# EAGLE design nico (EAGLE 7.1.0)
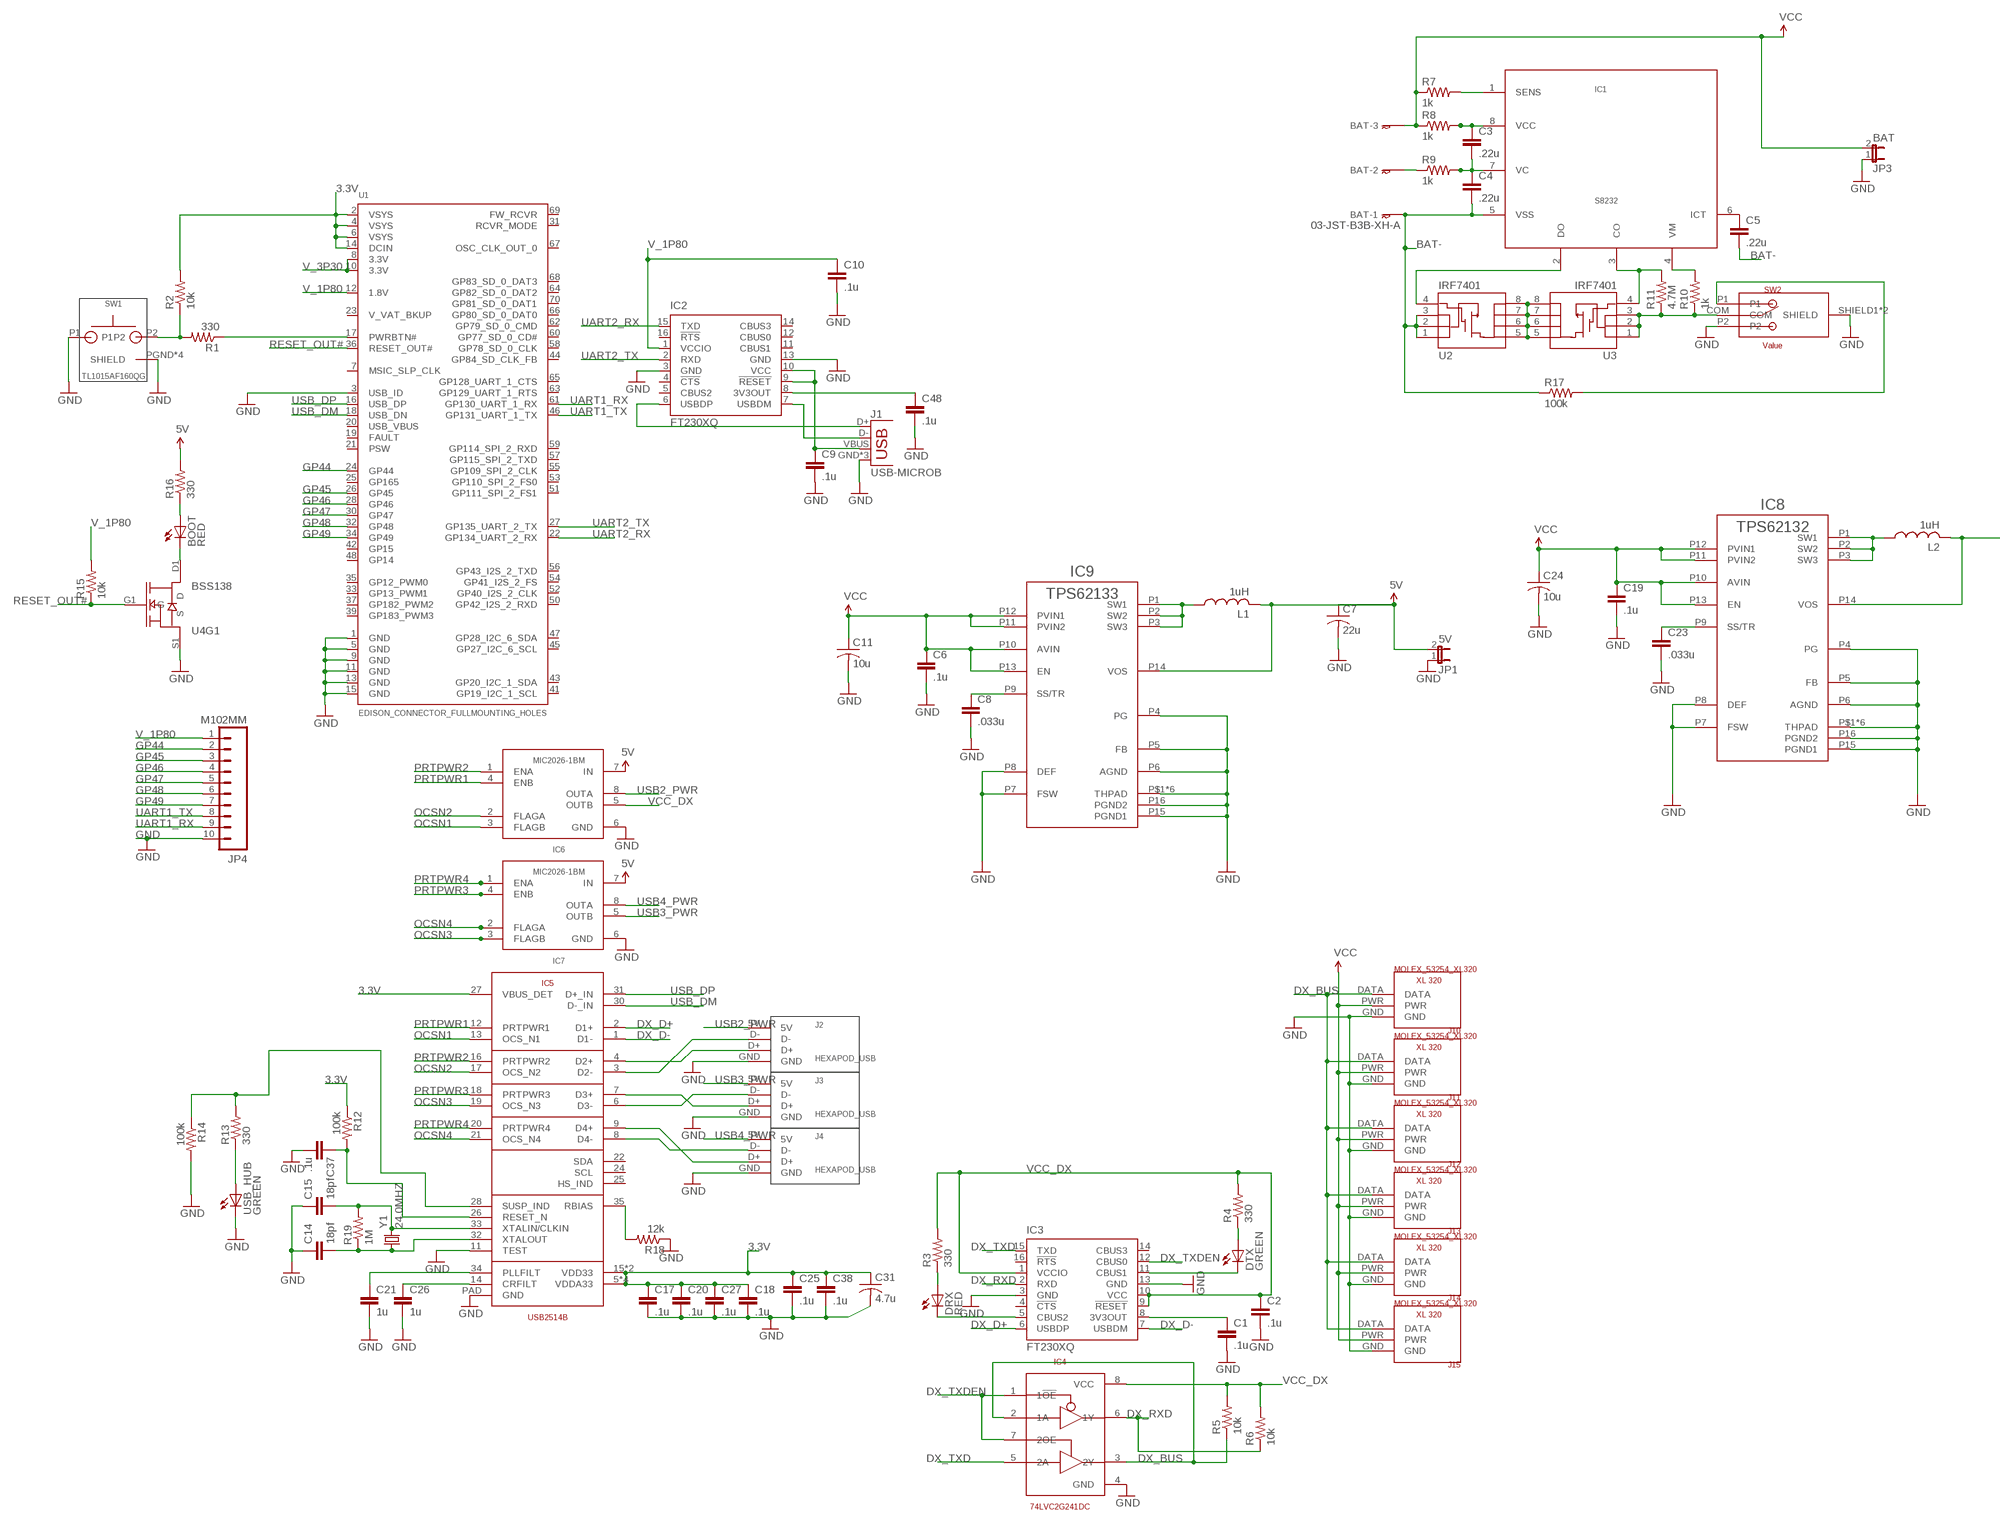
[diagram p0: schematic, sheet 1, part 1 of 2]
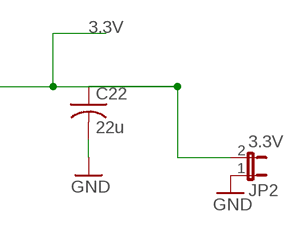
[diagram p1: schematic, sheet 1, part 2 of 2]

## Parts
BAT  03-JST-B3B-XH-A  [B3B-XH]
BOOT  RED  LED0603  [LED-0603]
C1  .1u  C-EUC0402  [C0402]
C2  .1u  C-EUC0402  [C0402]
C3  .22u  C-EUC0402  [C0402]
C4  .22u  C-EUC0402  [C0402]
C5  .22u  C-EUC0402  [C0402]
C6  .1u  C-EUC0402  [C0402]
C7  22u  C-USC0603  [C0603]
C8  .033u  C-EUC0402  [C0402]
C9  .1u  C-EUC0402  [C0402]
C10  .1u  C-EUC0402  [C0402]
C11  10u  C-USC0805  [C0805]
C14  18pf  C-EUC0402  [C0402]
C15  18pf  C-EUC0402  [C0402]
C17  .1u  C-EUC0402  [C0402]
C18  .1u  C-EUC0402  [C0402]
C19  .1u  C-EUC0402  [C0402]
C20  .1u  C-EUC0402  [C0402]
C21  1u  C-EUC0402  [C0402]
C22  22u  C-USC0603  [C0603]
C23  .033u  C-EUC0402  [C0402]
C24  10u  C-USC0805  [C0805]
C25  .1u  C-EUC0402  [C0402]
C26  1u  C-EUC0402  [C0402]
C27  .1u  C-EUC0402  [C0402]
C31  4.7u  C-USC0603  [C0603]
C37  .1u  C-EUC0402  [C0402]
C38  .1u  C-EUC0402  [C0402]
C48  .1u  C-EUC0402  [C0402]
DRX  RED  LED0603  [LED-0603]
DTX  GREEN  LED0603  [LED-0603]
IC1  S8232  [TSSOP8]
IC2  FT230XQ  [QFN16]
IC3  FT230XQ  [QFN16]
IC4  74LVC2G241DC  [VSSOP]
IC5  USB2514B  [36-QFN]
IC6  MIC2026-1BM  [8-SOIC]
IC7  MIC2026-1BM  [8-SOIC]
IC8  TPS62132  TPS62133  [VQFN-16]
IC9  TPS62133  [VQFN-16]
J1  USB-MICROB  [USB-MICROB]
J2  HEXAPOD_USB  [MOLEX_53254_4POS]
J3  HEXAPOD_USB  [MOLEX_53254_4POS]
J4  HEXAPOD_USB  [MOLEX_53254_4POS]
J10  MOLEX_53254_XL320  [MOLES_53254_XL320]
J11  MOLEX_53254_XL320  [MOLES_53254_XL320]
J12  MOLEX_53254_XL320  [MOLES_53254_XL320]
J13  MOLEX_53254_XL320  [MOLES_53254_XL320]
J14  MOLEX_53254_XL320  [MOLES_53254_XL320]
J15  MOLEX_53254_XL320  [MOLES_53254_XL320]
JP1  5V  JUMPER-2PTH  [1X02]
JP2  3.3V  JUMPER-2PTH  [1X02]
JP3  BAT  JUMPER-2PTH  [1X02]
JP4  M102MM  [1X10-2MM]
L1  1uH  L-USL2825P  [L2825P]
L2  1uH  L-USL2825P  [L2825P]
R1  330  R-US_R0402  [R0402]
R2  10k  R-US_R0402  [R0402]
R3  330  R-US_R0402  [R0402]
R4  330  R-US_R0402  [R0402]
R5  10k  R-US_R0402  [R0402]
R6  10k  R-US_R0402  [R0402]
R7  1k  RESISTOR0402  [C0402]
R8  1k  RESISTOR0402  [C0402]
R9  1k  RESISTOR0402  [C0402]
R10  1k  RESISTOR0402  [C0402]
R11  4.7M  RESISTOR0402  [C0402]
R12  100k  RESISTOR0402  [C0402]
R13  330  R-US_R0402  [R0402]
R14  100k  RESISTOR0402  [C0402]
R15  10k  R-US_R0402  [R0402]
R16  330  R-US_R0402  [R0402]
R17  100k  RESISTOR0402  [C0402]
R18  12k  RESISTOR0402  [C0402]
R19  1M  RESISTOR0402  [C0402]
SW1  TL1015AF160QG  [TL1015AF160QG]
SW2  TOGGLE_SWITCH_ET01MD1AGE  [TOGGLE_SWITCH_ET01MD1AGE]
U1  EDISON_CONNECTOR_FULLMOUNTING_HOLES  [EDISON_DAUGHTER]
U2  IRF7401  MOSFET-NCHANNEL-SOIC8  [SO08]
U3  IRF7401  MOSFET-NCHANNEL-SOIC8  [SO08]
U4  BSS138  [SOT363]
USB_HUB  GREEN  LED0603  [LED-0603]
Y1  24.0MHZ  CRYSTAL5X3  [CRYSTAL-SMD-5X3]

## Nets
3.3V: C17.1 C18.1 C20.1 C22.1 C25.1 C27.1 C31.1 C38.1 IC5.5(VDDA33) IC5.10(VDDA33) IC5.15(VDD33) IC5.23(VDD33) IC5.27(VBUS_DET) IC5.29(VDDA33) IC5.36(VDDA33) IC8.P14(VOS) JP2.2 L2.2 R2.2 R12.1 U1.2(VSYS) U1.4(VSYS) U1.6(VSYS) U1.14(DCIN)
5V: C7.1 IC6.7(IN) IC7.7(IN) IC9.P14(VOS) JP1.2 L1.2 R16.2
BAT-: BAT.P$1 C4.2 C5.2 IC1.5(VSS) R17.1 U2.1(S) U2.2(S) U2.3(S)
DX_BUS: IC4.2(1A) IC4.3(2Y) J10.DATA J11.DATA J12.DATA J13.DATA J14.DATA J15.DATA R5.1
DX_D+: IC3.6(USBDP) IC5.2(D1+)
DX_D-: IC3.7(USBDM) IC5.1(D1-)
DX_RXD: IC3.2(RXD) IC4.6(1Y) R6.1
DX_TXD: IC3.15(TXD) IC4.5(2A)
DX_TXDEN: IC3.12(CBUS0) IC4.1(1!OE) IC4.7(2OE)
GND [GND]: C1.2 C2.2 C6.2 C7.2 C8.2 C9.2 C10.2 C11.2 C14.1 C15.1 C17.2 C18.2 C19.2 C20.2 C21.2 C22.2 C23.2 C24.2 C25.2 C26.2 C27.2 C31.2 C37.2 C38.2 C48.2 IC2.3(GND) IC2.13(GND) IC3.3(GND) IC3.13(GND) IC4.4(GND) IC5.11(TEST) IC5.PAD(GND) IC6.6(GND) IC7.6(GND) IC8.P4(PG) IC8.P5(FB) IC8.P6(AGND) IC8.P7(FSW) IC8.P8(DEF) IC8.P15(PGND1) IC8.P16(PGND2) IC8.P$1(THPAD) IC8.P$2(THPAD) IC8.P$3(THPAD) IC8.P$4(THPAD) IC8.P$5(THPAD) IC8.P$6(THPAD) IC9.P4(PG) IC9.P5(FB) IC9.P6(AGND) IC9.P7(FSW) IC9.P8(DEF) IC9.P15(PGND1) IC9.P16(PGND2) IC9.P$1(THPAD) IC9.P$2(THPAD) IC9.P$3(THPAD) IC9.P$4(THPAD) IC9.P$5(THPAD) IC9.P$6(THPAD) J1.GND J1.MT1(GND) J1.MT2(GND) J2.GND J3.GND J4.GND J10.GND J11.GND J12.GND J13.GND J14.GND J15.GND JP1.1 JP2.1 JP3.1 JP4.10 R14.2 R18.1 SW1.P1 SW1.PGND2(SHIELD) SW1.PGND3(SHIELD) SW1.PGND4(SHIELD) SW1.PGND(SHIELD) SW2.P2 SW2.SHIELD1(SHIELD) SW2.SHIELD2(SHIELD) U1.1(GND) U1.3(USB_ID) U1.5(GND) U1.9(GND) U1.11(GND) U1.13(GND) U1.15(GND) U4.S1(S) USB_HUB.C
GP44: JP4.2 U1.24(GP44)
GP45: JP4.3 U1.26(GP45)
GP46: JP4.4 U1.28(GP46)
GP47: JP4.5 U1.30(GP47)
GP48: JP4.6 U1.32(GP48)
GP49: JP4.7 U1.34(GP49)
N$1: R1.2 R2.1 SW1.P2
N$2: DRX.C IC3.5(CBUS2)
N$3: C1.1 IC3.8(3V3OUT)
N$4: IC2.6(USBDP) J1.D+
N$5: C15.2 IC5.33(XTALIN/CLKIN) R19.2 Y1.3
N$6: C14.2 IC5.32(XTALOUT) R19.1 Y1.1
N$7: IC5.7(D3+) J3.D+
N$8: C3.2 C4.1 IC1.7(VC) R9.2
N$9: C3.1 IC1.8(VCC) R8.2
N$10: R1.1 U1.17(PWRBTN#)
N$11: C8.1 IC9.P9(SS/TR)
N$12: R13.1 USB_HUB.A
N$13: DTX.A R4.1
N$14: C21.1 IC5.34(PLLFILT)
N$15: C26.1 IC5.14(CRFILT)
N$16: DTX.C IC3.11(CBUS1)
N$17: IC8.P1(SW1) IC8.P2(SW2) IC8.P3(SW3) L2.1
N$18: IC2.7(USBDM) J1.D-
N$19: C37.1 IC5.26(RESET_N) R12.2
N$20: C9.1 IC2.9(!RESET) IC2.10(VCC) J1.VBUS
N$21: DRX.A R3.1
N$22: C23.1 IC8.P9(SS/TR)
N$23: IC5.9(D4+) J4.D+
N$24: IC5.28(SUSP_IND) R13.2 R14.1
N$25: C48.1 IC2.8(3V3OUT)
N$26: IC5.35(RBIAS) R18.2
N$27: IC5.8(D4-) J4.D-
N$28: C5.1 IC1.6(ICT)
N$29: IC1.1(SENS) R7.2
N$30: BAT.P$2 R9.1
N$31: IC5.6(D3-) J3.D-
N$32: IC1.4(VM) R10.2
N$33: R10.1 R11.1 SW2.COM U3.1(S) U3.2(S) U3.3(S)
N$34: BOOT.C U4.D1(D)
N$35: U2.5(D) U2.6(D) U2.7(D) U2.8(D) U3.5(D) U3.6(D) U3.7(D) U3.8(D)
N$36: BOOT.A R16.1
N$37: IC1.2(DO) U2.4(G)
N$38: IC1.3(CO) R11.2 U3.4(G)
N$39: IC5.3(D2-) J2.D-
N$40: IC5.4(D2+) J2.D+
N$41: IC9.P1(SW1) IC9.P2(SW2) IC9.P3(SW3) L1.1
N$42: R17.2 SW2.P1
OCSN1: IC5.13(OCS_N1) IC6.3(FLAGB)
OCSN2: IC5.17(OCS_N2) IC6.2(FLAGA)
OCSN3: IC5.19(OCS_N3) IC7.3(FLAGB)
OCSN4: IC5.21(OCS_N4) IC7.2(FLAGA)
PRTPWR1: IC5.12(PRTPWR1) IC6.4(ENB)
PRTPWR2: IC5.16(PRTPWR2) IC6.1(ENA)
PRTPWR3: IC5.18(PRTPWR3) IC7.4(ENB)
PRTPWR4: IC5.20(PRTPWR4) IC7.1(ENA)
RESET_OUT#: R15.1 U1.36(RESET_OUT#) U4.G1(G)
UART1_RX: JP4.9 U1.61(GP130_UART_1_RX)
UART1_TX: JP4.8 U1.46(GP131_UART_1_TX)
UART2_RX: IC2.15(TXD) U1.22(GP134_UART_2_RX)
UART2_TX: IC2.2(RXD) U1.27(GP135_UART_2_TX)
USB2_PWR: IC6.8(OUTA) J2.5V
USB3_PWR: IC7.5(OUTB) J3.5V
USB4_PWR: IC7.8(OUTA) J4.5V
USB_DM: IC5.30(D-_IN) U1.18(USB_DN)
USB_DP: IC5.31(D+_IN) U1.16(USB_DP)
V_1P80: C10.1 IC2.1(VCCIO) JP4.1 R15.2 U1.12(1.8V)
V_3P30: U1.8(3.3V) U1.10(3.3V)
VCC: BAT.P$3 C6.1 C11.1 C19.1 C24.1 IC8.P10(AVIN) IC8.P11(PVIN2) IC8.P12(PVIN1) IC8.P13(EN) IC9.P10(AVIN) IC9.P11(PVIN2) IC9.P12(PVIN1) IC9.P13(EN) J10.PWR J11.PWR J12.PWR J13.PWR J14.PWR J15.PWR JP3.2 R7.1 R8.1
VCC_DX: C2.1 IC3.1(VCCIO) IC3.9(!RESET) IC3.10(VCC) IC4.8(VCC) IC6.5(OUTB) R3.2 R4.2 R5.2 R6.2
Unconnected: IC2.4(!CTS) IC2.5(CBUS2) IC2.11(CBUS1) IC2.12(CBUS0) IC2.14(CBUS3) IC2.16(!RTS) IC3.4(!CTS) IC3.14(CBUS3) IC3.16(!RTS) IC5.22(SDA) IC5.24(SCL) IC5.25(HS_IND) U1.7(MSIC_SLP_CLK) U1.19(FAULT) U1.20(USB_VBUS) U1.21(PSW) U1.23(V_VAT_BKUP) U1.25(GP165) U1.31(RCVR_MODE) U1.33(GP13_PWM1) U1.35(GP12_PWM0) U1.37(GP182_PWM2) U1.39(GP183_PWM3) U1.41(GP19_I2C_1_SCL) U1.42(GP15) U1.43(GP20_I2C_1_SDA) U1.44(GP84_SD_CLK_FB) U1.45(GP27_I2C_6_SCL) U1.47(GP28_I2C_6_SDA) U1.48(GP14) U1.50(GP42_I2S_2_RXD) U1.51(GP111_SPI_2_FS1) U1.52(GP40_I2S_2_CLK) U1.53(GP110_SPI_2_FS0) U1.54(GP41_I2S_2_FS) U1.55(GP109_SPI_2_CLK) U1.56(GP43_I2S_2_TXD) U1.57(GP115_SPI_2_TXD) U1.58(GP78_SD_0_CLK) U1.59(GP114_SPI_2_RXD) U1.60(GP77_SD_0_CD#) U1.62(GP79_SD_0_CMD) U1.63(GP129_UART_1_RTS) U1.64(GP82_SD_0_DAT2) U1.65(GP128_UART_1_CTS) U1.66(GP80_SD_0_DAT0) U1.67(OSC_CLK_OUT_0) U1.68(GP83_SD_0_DAT3) U1.69(FW_RCVR) U1.70(GP81_SD_0_DAT1) U4.D2(D) U4.G2(G) U4.S2(S)

## Library data of the parts
BAT = con-jst-xh:03-JST: JST CONNECTOR
BOOT DRX DTX USB_HUB = SparkFun:LED: LEDs Standard schematic elements and footprints for 5mm, 3mm, 1206, and 0603 sized LEDs. 5mm - Spark Fun Electronics SKU : COM-00529 (and others)
C1-C6 C8-C10 C14 C15 C17-C21 C23 C25-C27 C37 C38 C48 = rcl:C-EU: CAPACITOR, European symbol
C7 C22 C31 = resistor:C-US: CAPACITOR, American symbol
C11 C24 = rcl:C-US: CAPACITOR, American symbol
IC1 = Edison:S8232
IC2 IC3 = ftdichip:FT230X: USB to BASIC UART IC Auto generated by make-symbol-device-package-bsdl.ulp Rev. 43 Source: Data sheet <http://www.ftdichip.com/Support/Documents/DataSheets/ICs/DS_FT230X.pdf>
IC4 = Edison:74LVC2G241DC
IC5 = Edison:USB2514B
IC6 IC7 = Edison:MIC2026-1BM
IC8 IC9 = Edison:TPS62133
J1 = SparkFun-Connectors:USB: USB Connectors USB-B-PTH is fully proven SKU : PRT-00139/CONN-08278 USB-miniB is fully proven SKU : PRT-00587 USB-A-PCB is untested. USB-A-H is throughly reviewed, but untested. Spark Fun Electronics SKU : PRT-00437 USB-B-SMT is throughly reviewed, but untested. Needs silkscreen touching up. USB-A-S has not been used/tested USB-MB-H has not been used/tested USB-MICROB has been used. CONN-09505; PROD_ID: CONN-09505
J2-J4 = Edison:HEXAPOD_USB
J10-J15 = Edison:MOLEX_53254_XL320
JP1-JP3 = SparkFun:JUMPER-2: Jumper Basic 0.1" spaced jumper. Use with breakaway headers.
JP4 = SparkFun:M10: Header 10 Standard 10-pin 0.1" header. Use with straight break away headers (SKU : PRT-00116), right angle break away headers (PRT-00553), swiss pins (PRT-00743), machine pins (PRT-00117), and female headers (PRT-00115).
L1 L2 = rcl:L-US: INDUCTOR, American symbol
R1-R6 R13 R15 R16 = rcl:R-US_: RESISTOR, American symbol
R7-R12 R14 R17-R19 = SparkFun:RESISTOR: Resistor Basic schematic elements and footprints for 0603, 1206, and PTH 1/10th watt (small) resistors.
SW1 = Edison:TL1015AF160QG
SW2 = Edison:TOGGLE_SWITCH_ET01MD1AGE
U1 = Edison:EDISON_CONNECTOR_FULL
U2 U3 = SparkFun:MOSFET-NCHANNEL-SOIC8: N-Channel MOSFET IRF9410 and NDS8434 are common, SOIC-8 parts.
U4 = Edison:BSS138
Y1 = SparkFun:CRYSTAL: Crystals Various standard crystals. Proven footprints. Spark Fun Electronics SKU : COM-00534

## Net classes
1 GND: width 0.178 mm

## Board
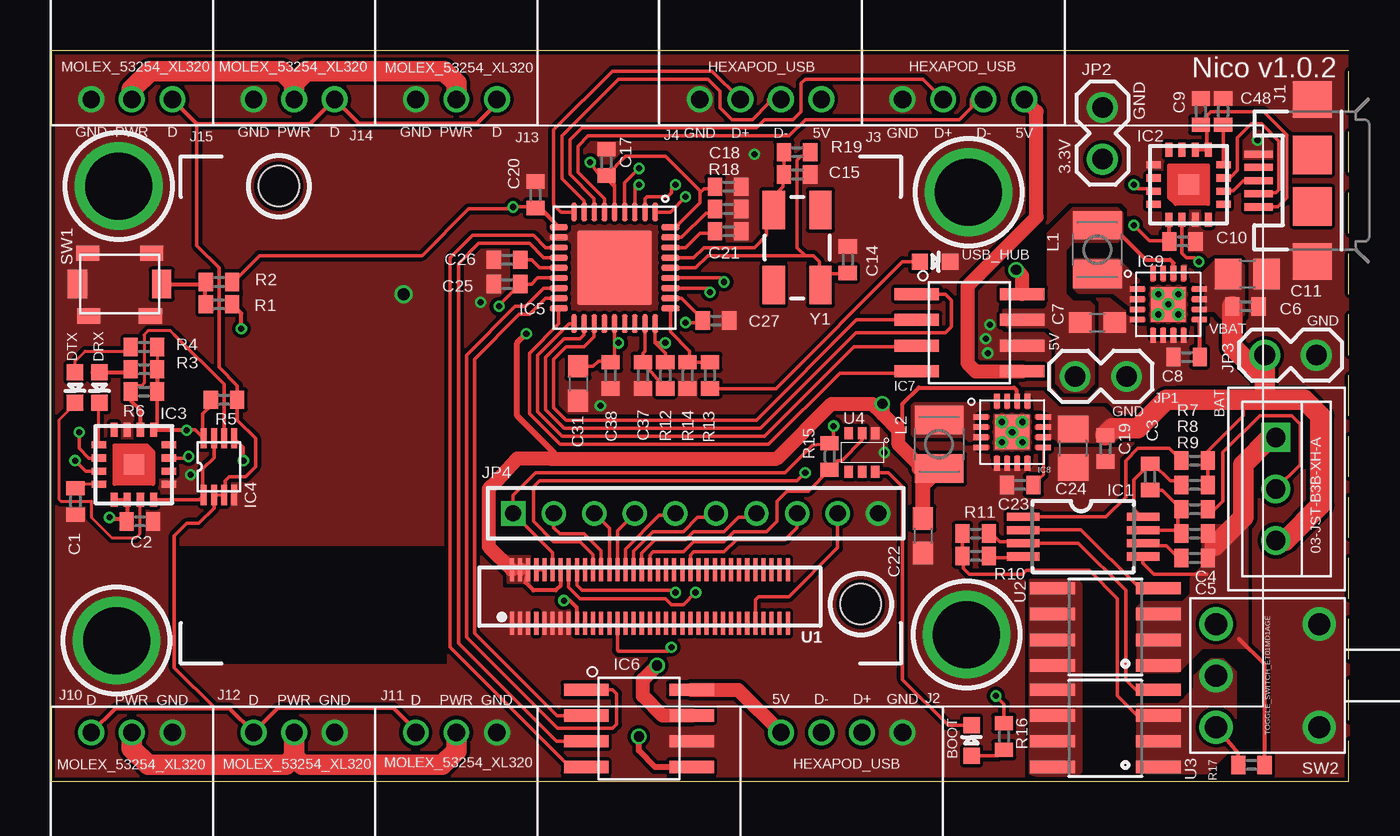
[diagram p2: board, top side]
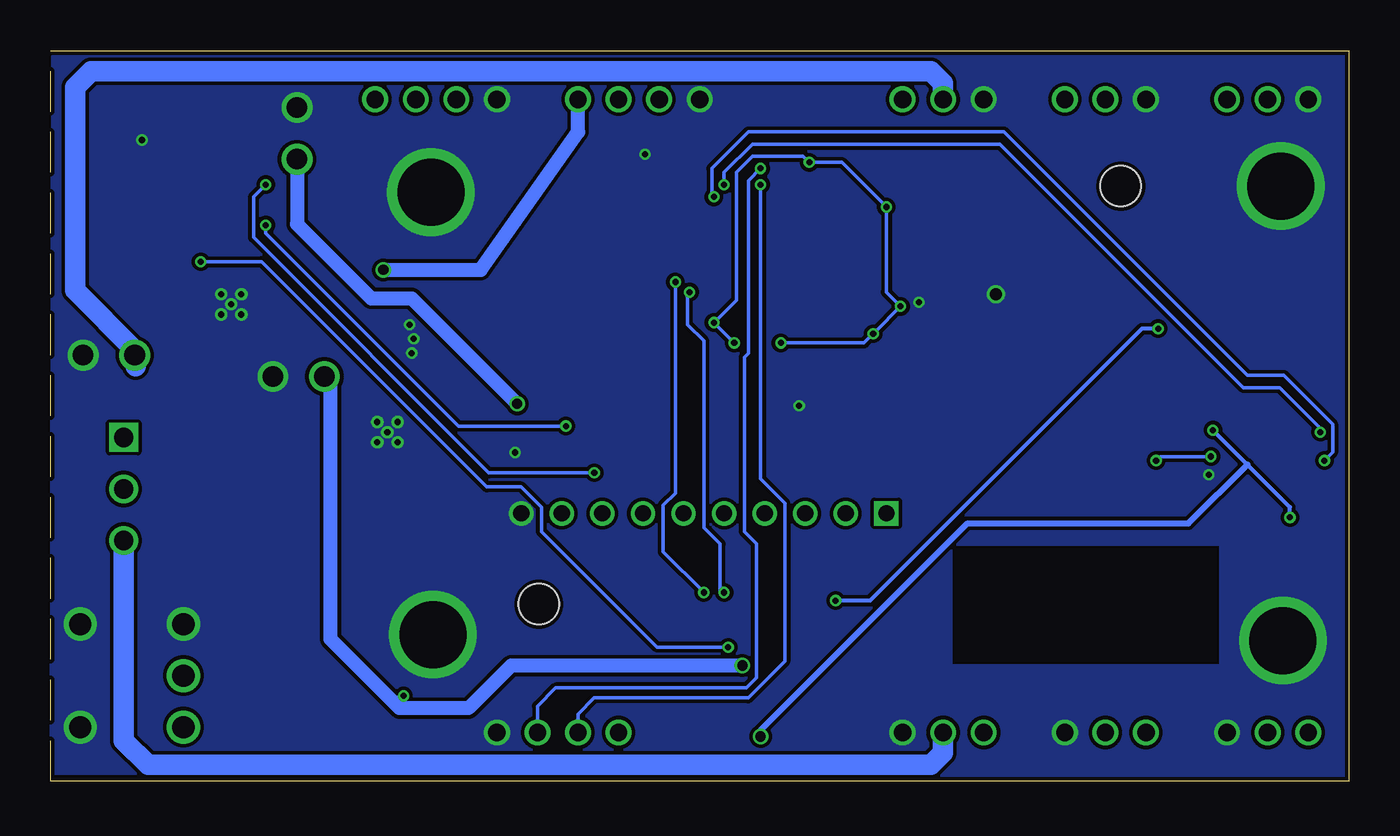
[diagram p3: board, bottom side, seen from below]

Size 64 x 36 mm. Coordinates in mm from the lower left corner, seen from the top.
Outline: 0,0 64,0 64,36 0,36 0,0
Copper layers (1*16): Top 0.035mm / dielectric 1.5mm / Bottom 0.035mm
Design rules "default *": minimum track width 5.5mil, minimum drill 10mil, track to track 7mil, track to pad 7mil, pad to pad 7mil, via to via 7mil, smd to smd 7mil, copper to edge 8mil, drill to drill 6mil, minimum pad ring 6mil, minimum via ring 5mil, stop-mask expansion 4mil, vias tented up to drill 0mil, thermal gap 10mil

### Footprints (pad centres in the part's own frame; a part is rotated, then mirrored left to right if it is on the bottom)
B3B-XH = drill 0.95 square: P$1 -2.54,0 | drill 0.95: P$2 0,0; P$3 2.54,0
LED-0603 = smd 0.8 x 0.8: A 0,-0.75; C 0,0.75
C0402 = smd 0.7 x 0.9: 1 -0.65,0; 2 0.65,0
C0603 = smd 1.1 x 1: 1 -0.85,0; 2 0.85,0
C0805 = smd 1.3 x 1.5: 1 -0.95,0; 2 0.95,0
TSSOP8 = smd 0.4 x 1.6: 1 -1.025,-2.85; 2 -0.375,-2.85; 3 0.275,-2.85; 4 0.925,-2.85; 5 0.925,3.05; 6 0.275,3.05; 7 -0.375,3.05; 8 -1.025,3.05
QFN16 = smd 0.7 x 0.35: 1 -1.725,0.975; 2 -1.725,0.325; 3 -1.725,-0.325; 4 -1.725,-0.975; 9 1.725,-0.975; 10 1.725,-0.325; 11 1.725,0.325; 12 1.725,0.975 | smd 0.35 x 0.7: 5 -0.975,-1.725; 6 -0.325,-1.725; 7 0.325,-1.725; 8 0.975,-1.725; 13 0.975,1.725; 14 0.325,1.725; 15 -0.325,1.725; 16 -0.975,1.725 | smd 1 x 1: TAB 0,0
VSSOP = smd 0.295 x 1: 1 0.75,1.4; 2 0.25,1.4; 3 -0.25,1.4; 4 -0.75,1.4; 5 -0.75,-1.4; 6 -0.25,-1.4; 7 0.25,-1.4; 8 0.75,-1.4
36-QFN = smd 0.9 x 0.28: 1 -2.75,2; 2 -2.75,1.5; 3 -2.75,1; 4 -2.75,0.5; 5 -2.75,0; 6 -2.75,-0.5; 7 -2.75,-1; 8 -2.75,-1.5; 9 -2.75,-2; 19 2.75,-2; 20 2.75,-1.5; 21 2.75,-1; 22 2.75,-0.5; 23 2.75,0; 24 2.75,0.5; 25 2.75,1; 26 2.75,1.5; 27 2.75,2 | smd 0.28 x 0.9: 10 -2,-2.75; 11 -1.5,-2.75; 12 -1,-2.75; 13 -0.5,-2.75; 14 0,-2.75; 15 0.5,-2.75; 16 1,-2.75; 17 1.5,-2.75; 18 2,-2.75; 28 2,2.75; 29 1.5,2.75; 30 1,2.75; 31 0.5,2.75; 32 0,2.75; 33 -0.5,2.75; 34 -1,2.75; 35 -1.5,2.75; 36 -2,2.75 | smd 3.7 x 3.7: PAD 0,0
8-SOIC = smd 2.2 x 0.6: 1 -2.6,1.905; 2 -2.6,0.635; 3 -2.6,-0.635; 4 -2.6,-1.905; 5 2.6,-1.905; 6 2.6,-0.635; 7 2.6,0.635; 8 2.6,1.905
VQFN-16 = smd 0.71 x 0.28: P1 -1.545,0.75; P2 -1.545,0.25; P3 -1.545,-0.25; P4 -1.545,-0.75; P9 1.545,-0.75; P10 1.545,-0.25; P11 1.545,0.25; P12 1.545,0.75 | smd 0.28 x 0.71: P5 -0.75,-1.545; P6 -0.25,-1.545; P7 0.25,-1.545; P8 0.75,-1.545; P13 0.75,1.545; P14 0.25,1.545; P15 -0.25,1.545; P16 -0.75,1.545 | smd 1.7 x 1.7: P$1 0,0 | drill 0.3 pad 0.508: P$2 -0.5,0.5; P$3 0.5,0.5; P$4 0,0; P$5 0.5,-0.5; P$6 -0.5,-0.5
USB-MICROB = smd 0.35 x 1.4: D+ 0,2.65; D- -0.65,2.65; GND 1.3,2.65; ID 0.65,2.65; VBUS -1.3,2.65 | smd 1.8 x 1.9: MT1 -4,0; MT2 4,0 | smd 1.9 x 1.9: P$1 -1.27,0; P$2 1.27,0
MOLEX_53254_4POS = drill 0.85: 5V 4,0; D+ 0,0; D- 2,0; GND -2,0
MOLES_53254_XL320 = drill 0.85: DATA 2,0; GND -2,0; PWR 0,0
1X02 = drill 1.016: 1 0,0; 2 2.54,0
1X10-2MM = drill 0.8 square: 1 0,0 | drill 0.8: 2 2,0; 3 4,0; 4 6,0; 5 8,0; 6 10,0; 7 12,0; 8 14,0; 9 16,0; 10 18,0
L2825P = smd 1.4 x 2.4: 1 -1.2,0; 2 1.2,0
R0402 = smd 0.7 x 0.9: 1 -0.65,0; 2 0.65,0
TL1015AF160QG = smd 0.95 x 1.4: P1 -2.075,0; P2 2.075,0 | smd 1.15 x 0.75: PGND -1.575,1.525; PGND2 1.575,1.525; PGND3 1.525,-1.575; PGND4 -1.525,-1.575
TOGGLE_SWITCH_ET01MD1AGE = drill 1.092: COM 0,2.54; P1 -2.54,2.54; P2 2.54,2.54; SHIELD1 -2.54,-2.54; SHIELD2 2.54,-2.54
EDISON_DAUGHTER = smd 1.14 x 0.2: 1 -0.95,17.21; 2 1.69,17.21; 3 -0.95,16.81; 4 1.69,16.81; 5 -0.95,16.41; 6 1.69,16.41; 7 -0.95,16.01; 8 1.69,16.01; 9 -0.95,15.61; 10 1.69,15.61; 11 -0.95,15.21; 12 1.69,15.21; 13 -0.95,14.81; 14 1.69,14.81; 15 -0.95,14.41; 16 1.69,14.41; 17 -0.95,14.01; 18 1.69,14.01; 19 -0.95,13.61; 20 1.69,13.61; 21 -0.95,13.21; 22 1.69,13.21; 23 -0.95,12.81; 24 1.69,12.81; 25 -0.95,12.41; 26 1.69,12.41; 27 -0.95,12.01; 28 1.69,12.01; 29 -0.95,11.61; 30 1.69,11.61; 31 -0.95,11.21; 32 1.69,11.21; 33 -0.95,10.81; 34 1.69,10.81; 35 -0.95,10.41; 36 1.69,10.41; 37 -0.95,10.01; 38 1.69,10.01; 39 -0.95,9.61; 40 1.69,9.61; 41 -0.95,9.21; 42 1.69,9.21; 43 -0.95,8.81; 44 1.69,8.81; 45 -0.95,8.41; 46 1.69,8.41; 47 -0.95,8.01; 48 1.69,8.01; 49 -0.95,7.61; 50 1.69,7.61; 51 -0.95,7.21; 52 1.69,7.21; 53 -0.95,6.81; 54 1.69,6.81; 55 -0.95,6.41; 56 1.69,6.41; 57 -0.95,6.01; 58 1.69,6.01; 59 -0.95,5.61; 60 1.69,5.61; 61 -0.95,5.21; 62 1.69,5.21; 63 -0.95,4.81; 64 1.69,4.81; 65 -0.95,4.41; 66 1.69,4.41; 67 -0.95,4.01; 68 1.69,4.01; 69 -0.95,3.61; 70 1.69,3.61 | hole 2: 20.6,28.71; 0,0.02
SO08 = smd 0.61 x 2.21: 1 -1.905,-2.616; 2 -0.635,-2.616; 3 0.635,-2.616; 4 1.905,-2.616; 5 1.905,2.616; 6 0.635,2.616; 7 -0.635,2.616; 8 -1.905,2.616
SOT363 = smd 0.42 x 0.6: D1 0.65,-0.95; D2 -0.65,0.95; G1 0,0.95; G2 0,-0.95; S1 0.65,0.95; S2 -0.65,-0.95
CRYSTAL-SMD-5X3 = smd 1.9 x 1.1: 1 -1.85,-1.15; 2 1.85,-1.15; 3 1.85,1.15; 4 -1.85,1.15

### Placement (x,y rotation side)
BAT  60.4,14.4 270 top
BOOT  45.4,2 0 top
C1  1.22,13.79 270 top
C2  4.4,12.8 0 top
C3  54.2,15 270 top
C4  56.4,12.2 0 top
C5  56.4,11 0 top
C6  58.9,23.4 0 top
C7  51.6,22.6 0 top
C8  56,20.9 180 top
C9  56.7,33 90 top
C10  55.8,26.6 0 top
C11  59,25 0 top
C14  39.3,25.7 270 top
C15  36.8,29.9 180 top
C17  27.4,30.5 90 top
C18  33.4,29.3 0 top
C19  52,16.4 270 top
C20  23.9,28.9 90 top
C21  33.4,27.1 0 top
C22  43,12.1 270 top
C23  47.8,14.6 180 top
C24  50.4,16.4 270 top
C25  22.5,24.5 180 top
C26  22.5,25.7 180 top
C27  32.8,22.7 0 top
C31  26,19.6 270 top
C37  29.2,20 270 top
C38  27.6,20 270 top
C48  57.8,33 90 top
DRX  2.4,19.4 180 top
DTX  1.2,19.4 180 top
IC1  50.8,12 270 top
IC2  56.1,29.4 90 top
IC3  4.1,15.6 270 top
IC4  8.3,15.5 180 top
IC5  27.8,25.3 270 top
IC6  29,2.6 0 top
IC7  45.3,22.1 0 top
IC8  47.4,17.2 0 top
IC9  55.1,23.5 0 top
J1  62.2,29.6 90 top
J2  40,2.4 180 top
J3  44,33.6 0 top
J4  34,33.6 0 top
J10  4,2.4 180 top
J11  20,2.4 180 top
J12  12,2.4 180 top
J13  20,33.6 0 top
J14  12,33.6 0 top
J15  4,33.6 0 top
JP1  53.05,19.95 180 top
JP2  51.86,33.2 270 top
JP3  62.4,21 180 top
JP4  22.8,13.2 0 top
L1  51.6,26.2 90 top
L2  43.8,16.6 270 top
R1  8.3,23.5 180 top
R2  8.3,24.6 0 top
R3  4.6,20.3 0 top
R4  4.6,21.4 0 top
R5  8.55,18.8 180 top
R6  4.6,19.2 0 top
R7  56.4,15.8 180 top
R8  56.4,14.6 180 top
R9  56.4,13.4 180 top
R10  45.6,11.1 0 top
R11  45.6,12.2 0 top
R12  30.3,20 270 top
R13  32.5,20 90 top
R14  31.4,20 270 top
R15  38.4,16 90 top
R16  47,2.2 90 top
R17  59.2,0.8 180 top
R18  33.4,28.2 180 top
R19  36.8,31 180 top
SW1  3.4,24.5 0 top
SW2  60,5.2 90 top
U1  39.95,8.73 90 top
U2  52,7.6 90 top
U3  52,2.6 90 top
U4  40,16.2 0 top
USB_HUB  43.6,25.6 270 top
Y1  36.8,26.3 90 top

### Tracks (layer width: path | path; a pad name or v marks a point on that pad's centre or on a via)
3.3V  (via drill 0.3, 0.5)
  Top 0.175: IC5.15 24,24.8 23.7,24.5 C25.1 22.1,23.45 v22.1,23.4 | C20.1 24.25,28.1 IC5.10 25.05,27.35 24.1,28.3 v22.8,28.3 22.7,28.2 20.6,28.2 18.3,25.9 10.3,25.9 9,24.6 R2.2 | IC5.29 31.1,23.8 32.15,22.75 C27.1 32.05,22.6 v31.3,22.6 | R12.1 30.3,21.1 29.8,21.6 | C31.1 26.75,20.45 27,20.7 27.55,20.7 C38.1 27.8,20.85 IC5.23 27.8,21.8 v28,21.6 | 32,29 32,28.5 30.8,27.3 IC5.36 | 32,29 32.2,29.2 32.65,29.2 C18.1 | IC5.27 29.8,21.6 | 29.8,21.6 v30.3,21.6 | 32,29 32,29.1 30.3,30.8 28.35,30.8 C17.1 27.25,29.85 27.8,29.3 IC5.5 27.8,29.4 27.4,29.8 27.1,29.8 v26.6,30.5
  Top 0.2: U1.14 25.14,9.64 24.9,9.4 23.8,9.4 23.4,9.8 23.5,10.37 U1.6 | L2.2 43.3,15.4 42,16.7 42,18.6 42.8,19.4 47.5,19.4 47.6,19.3 47.6,18.8 IC8.P14
  Top 0.3: v23.45,22.05 23,21.6 23,18 24.8,16.2 24.8,16.1 24.6,15.9
  Top 0.6: L2.2 42.8,15.4 | 23.2,10.47 U1.4
  Top 0.7: v41,18.6 41,18.1 | 41,18.1 40.5,18.6 38.5,18.6 35.8,15.9 24.6,15.9 23,15.9 22,14.8 21.6,14.4 21.6,11.56 U1.2 | 42.8,15.4 42.8,15.6 41.8,16.6 41.8,17.3 41,18.1
  Top 0.75: C22.1 43,14.6 L2.2
  Bottom 0.175: v30.3,21.6 v31.3,22.6 30.2,23.7 30.2,30 29.4,30.8 26.9,30.8 v26.6,30.5 25,30.5 v22.8,28.3 22.8,24.1 v22.1,23.4 23.35,22.15 | v28,21.6 23.9,21.6 v23.45,22.05
  Bottom 0.3: v23.45,22.05 23.35,22.15
  Bottom 0.7: JP2.2 51.86,27.46 48.2,23.8 46.2,23.8 v41,18.6
  pour Top (no thermals): 22.55,11.07 23.72,11.07 23.72,9.8 22.55,9.8
5V  (via drill 0.3, 0.5)
  Top 0.175: R16.2 47,3.8 v46.6,4.2
  Top 0.2: IC9.P14 55.35,25.55 55.2,25.7 54,25.7 52.3,27.4 L1.2
  Top 0.7: IC6.7 30.16,3.23 29.2,4.2 29.2,5 v29.9,5.7
  Bottom 0.175: v46.6,4.2 46.8,4.2 47.1,3.9
  Bottom 0.7: 50.36,19.8 JP1.2 50.2,19.64 50.2,7 47.1,3.9 46.8,3.6 43.4,3.6 41.3,5.7 v29.9,5.7
  pour Top (no thermals): 47,23.2 49,23.2 49.2,23.4 49.2,27 50.4,28.2 52.6,28.2 52.8,28 52.8,26.8 52.6,26.6 50.4,26.6 50,26.2 50,24 50.4,23.6 51.2,23.6 51.4,23.4 51.4,19.6 51,19.2 50,19.2 49.6,19.6 49.6,22 49.2,22.4 47.2,22.4 47,22.6
BAT-
  Top 0.178: IC1.5 53.85,10.75 54.4,10.2 57,10.2
  Top 0.2: R17.1 59.85,5.75 58.6,7
  Top 1.016: BAT.P$1 60.14,16.94 58.8,15.6 58.8,13 57.4,11.6
  pour Top (no thermals): 53.8,5.4 55.6,5.4 56.8,6.6 59,6.6 59,12.6 56.8,12.6 56.8,10.6 56.2,10 56.2,9.2 55.8,8.8 53.8,8.8 53.6,8.6 53.6,5.6
DX_BUS
  Top 0.15: IC4.3 IC4.2
  Top 0.175: 7.2,32.4 7.2,26.4 8.3,25.3 8.3,20.4 9.2,19.5 R5.1 9.2,17.8 10.1,16.9 10.1,15.5 9.6,15 8.8,15 8.6,14.8 8.6,14.15 IC4.3 | 8.8,3.6 8.1,3.6 6.1,5.6 6.1,12.1 6.7,12.7 7.3,12.7 8.05,13.45 IC4.2
  Top 0.2: J10.DATA 3.2,3.6 8.8,3.6 J12.DATA 11.2,3.6 16.9,3.6 18,2.5 J11.DATA | J15.DATA 7.2,32.4 12.8,32.4 J14.DATA 15.2,32.4 21,32.4 22,33.4 J13.DATA
DX_D+  (via drill 0.3)
  Top 0.175: IC3.6 1.88,15.93 1.4,16.4 v1.4,17.2 | IC5.2 29.3,28.7 29.4,28.8 30.4,28.8 30.6,29 30.6,29.2 v30.8,29.4
  Bottom 0.175: v1.4,17.2 1.4,17.4 3.4,19.4 5.2,19.4 17.2,31.4 29.4,31.4 30.8,30 v30.8,29.4
DX_D-  (via drill 0.3)
  Top 0.175: IC5.1 30.55,28.05 v31.3,28.8 | IC3.7 1.73,15.28 v1.2,15.8
  Bottom 0.175: 31.2,28.9 v31.3,28.8 31.4,28.9 31.4,30.2 29.6,32 17,32 5,20 3.2,20 0.8,17.6 0.8,16.2 v1.2,15.8
DX_RXD
  Top 0.15: 6.1,22 5.9,22.2 4.8,22.2 4.6,22 4.6,19.6 4.5,19.5 4.25,19.5 R6.1
  Top 0.175: IC4.6 8.55,19.55 6.1,22
  Top 0.2: R6.1 3.95,18.75 4.4,18.3 4.4,17.35 IC3.2
DX_TXD  (via drill 0.3)
  Top 0.175: IC3.15 6.72,15.93 v6.8,16 | v9.5,15.8 9.5,16.45 IC4.5
  Bottom 0.175: v6.8,16 9.3,16 v9.5,15.8
DX_TXDEN
  Top 0.175: IC3.12 7.33,13.88 IC4.1 7.5,14.15 7.5,15.4 8.05,15.95 IC4.7
GND  (via drill 0.3, 0.6, 3.3 pad 0.01)
  other vias: 45.15,7.23 45.25,29.03 3.35,29.33 3.25,6.93 59.5,31.6 27.1,18.5 21.2,23.6 46.2,21.1 46.3,22.5 34.7,30.9 41.1,16.2 17.4,24 46.1,21.8 6.9,15.1
  pour Bottom (no thermals): 0.25,35.76 63.91,35.74 63.96,0.4 0.22,0.16
  pour Top (rank 2, no thermals): 0.91,35.86 63.91,35.76 63.96,0.2 0.16,0.06 0.25,35.74
GP44
  Top 0.175: JP4.2 24.8,12.5 25.1,12.2 26.3,12.2 27.14,11.36 U1.24
GP45
  Top 0.175: U1.26 27.54,12.46 JP4.3
GP46
  Top 0.175: U1.28 27.94,12.34 JP4.4
GP47
  Top 0.175: U1.30 28.34,11.44 30,13.1 30.7,13.1 JP4.5
GP48
  Top 0.175: U1.32 28.74,11.34 29.7,12.3 31.2,12.3 31.9,13 32.6,13 JP4.6
GP49
  Top 0.175: U1.34 29.14,11.24 29.8,11.9 31.3,11.9 31.7,12.3 33.2,12.3 33.9,13 34.6,13 JP4.7
N$1
  Top 0.2: SW1.P2 7.55,24.5 R2.1 7.6,24.65 R1.2
N$2
  Top 0.15: IC3.5 2.38,18.27 DRX.C
N$3
  Top 0.15: IC3.8 1.41,14.62 C1.1
N$4
  Top 0.175: J1.D+ 58.8,29.6 58.3,29.1 57.85,29.1 IC2.6
N$5
  Top 0.175: R19.2 C15.2 36.1,29.85 36.1,29.3 35.65,28.85 Y1.3 35.3,27.8 35.3,26.9 34.7,26.3 32.2,26.3 31.7,25.8 IC5.33
N$6
  Top 0.175: IC5.32 31.8,25.3 32.4,25.9 37.2,25.9 | C14.2 39.25,25 38.5,25 Y1.1 37.9,24.5 37.9,25.6 37.6,25.9 37.2,25.9 | 37.2,25.9 36.8,26.3 36.8,30.6 37,30.8 37.25,30.8 R19.1
N$7
  Top 0.175: IC5.7 26.8,28.7 25.6,29.9 25.6,31.6 26.2,32.2 34.8,32.2 35.2,32.6 36.6,32.6 37,33 37,34.4 37.2,34.6 43,34.6 J3.D+
N$8
  Top 0.178: IC1.7 55.58,12.38 | 55.58,12.38 C4.1 | 55.58,12.38 55.58,13.22 R9.2 54.8,14.35 C3.2
N$9
  Top 0.178: IC1.8 53.77,13.03 53.4,13.4 53.4,14.85 C3.1 54.35,15.65 55.2,14.8 55.55,14.8 R8.2
N$10  (via drill 0.3)
  Top 0.2: U1.17 25.94,8.56 25.6,8.9 v25.3,8.9 | v9.4,22.3 9.4,23.05 R1.1
  Bottom 0.2: v9.4,22.3 10.2,22.3 23.6,8.9 v25.3,8.9
N$11
  Top 0.2: C8.1 56.65,22.55 IC9.P9
N$12
  Top 0.175: R13.1 35.75,19.35 42,25.6 USB_HUB.A
N$13
  Top 0.15: DTX.A 1.2,20.7 1.7,21.2 3.75,21.2 R4.1
N$14
  Top 0.175: IC5.34 31.3,26.3 32,27 32.65,27 C21.1
N$15
  Top 0.175: IC5.14 24.1,25.3 23.7,25.7 C26.1
N$16
  Top 0.15: DTX.C 1.2,18.6 0.4,17.8 0.4,13.9 0.5,13.8 2,13.8 2,13 3,12 4.2,12 4.4,12.2 4.4,13.85 IC3.11
N$17
  pour Top (no thermals): 46.3,18.5 46.3,16.9 46.2,16.8 45.3,16.8 45.1,17 42.6,17 42.5,17.1 42.5,18.5 42.6,18.6 46.2,18.6
N$18
  Top 0.175: IC2.7 58.12,29.73 58.5,30.1 58.5,31.7 59.2,32.4 59.7,32.4 60.55,31.55 60.55,29.15 60.4,29 59.6,29 J1.D-
N$19
  Top 0.175: R12.2 C37.1 29.2,21.1 29.3,21.2 IC5.26
N$20
  Top 0.175: J1.VBUS 60.5,28.3 60.95,28.75 60.95,31.85 59.8,33 57.2,33 57,32.8 57,32.4 | 57,32.4 57,31.2 IC2.9 IC2.10 | C9.1 56.95,32.35 57,32.4
N$21
  Top 0.15: DRX.A 2.05,20.15
  Top 0.2: 2.05,20.15 3.8,20.15 R3.1
N$22
  Top 0.152: IC8.P9 48.95,15.1 C23.1
N$23
  Top 0.175: IC5.9 25.15,28.05 24.8,28.4 24.8,32.1 27.7,35 32.6,35 J4.D+
N$24
  Top 0.175: IC5.28 30.55,22.15 31.5,21.2 31.5,20.75 R14.1 R13.2
N$25
  Top 0.175: IC2.8 57.83,32.33 C48.1
N$26
  Top 0.175: IC5.35 31.1,26.8 32.3,28 32.55,28 R18.2
N$27
  Top 0.175: IC5.8 26.3,28.6 25.2,29.7 25.2,31.8 28,34.6 32.4,34.6 33,34 33,33.2 33.6,32.6 34.6,32.6 35.4,33.4 35.4,33.6 J4.D-
N$28
  Top 0.178: C5.1 55.6,11 55,11.6 53.98,11.6 IC1.6
N$29
  Top 0.178: IC1.1 52.02,13.03 53,14 53,15.8 53.6,16.4 55.15,16.4 R7.2
N$30
  Top 0.178: R9.1 57.4,13.4 57.8,13.8 57.8,16.2 59.6,18 61.2,18 61.6,17.6 61.6,15.6 BAT.P$2
N$31
  Top 0.175: IC5.6 27.3,28.7 26,30 26,31.3 26.5,31.8 36.4,31.8 37.2,32.6 44.8,32.6 45.4,33.2 45.4,33.6 J3.D-
N$32
  Top 0.178: R10.2 46.4,11.2 46.4,11 47.88,11 IC1.4
N$33
  Top 0.175: 51.2,10.4 48.1,10.4 47.9,10.2 45.3,10.2 45,10.5 45,11.05 R10.1
  Top 0.178: U3.3 53.56,3.23 52.6,4.2 52.6,9 51.2,10.4 | R11.1 R10.1
  pour Top (no thermals): 53.6,3.8 55.6,3.8 56.4,4.6 56.4,5.2 57.2,6 57.8,6 58.4,5.4 58.4,1.8 57,0.4 54,0.4 53.6,0.6
N$34
  Top 0.175: BOOT.C 44.25,2.75 42,5 42,14.5 41.3,15.2 40.7,15.2 U4.D1
N$35
  pour Top (no thermals): 48.3,9.9 50.6,9.9 50.8,9.7 50.8,0.5 50.6,0.3 48.6,0.3 48.3,0.4
N$36
  Top 0.175: BOOT.A 46.7,1.25 R16.1
N$37
  Top 0.178: U2.4 53.7,9.51 50.8,12.4 47.98,12.4 IC1.2
N$38
  Top 0.178: U3.4 54.71,4.4 53.6,4.4 53,5 53,9.4 50.67,11.72 IC1.3 47.88,11.8 46.8,11.8 46.2,12.4 R11.2
N$39  (via drill 0.3)
  Top 0.175: IC5.3 28.8,29.4 v29,29.4
  Bottom 0.175: J2.D- 38,3.3 37.2,4.1 29.6,4.1 27.8,5.9 27.8,13.7 29,14.9 v29,29.4
N$40  (via drill 0.3)
  Top 0.175: IC5.4 28.3,29.5 v29,30.2
  Bottom 0.175: J2.D+ 40,3.7 39.1,4.6 29.7,4.6 29.2,5.1 29.2,11.7 29.8,12.3 29.8,20.9 29.6,21.1 29.6,29.6 v29,30.2
N$41
  pour Top (no thermals): 50.5,25.7 52.6,25.7 54,24.3 54,23.2 53.5,23.2 52.4,24.1 50.7,24.1 50.5,24.3
N$42
  Top 0.2: R17.2 58.55,1.37 SW2.P1
OCSN1
  Top 0.175: IC6.3 24.93,1.97 20.1,6.8 20.1,25.5 21.1,26.5 23.6,26.5 24.3,25.8 IC5.13
OCSN2
  Top 0.175: IC6.2 24.96,3.23 20.9,7.3 20.9,20.8 23.1,23 23.6,23 24.4,23.8 IC5.17
OCSN3
  Top 0.175: IC5.19 25.55,22.55 24,21 24,18.2 25.2,17 35.2,17 39.6,21.4 42.63,21.4 IC7.3
OCSN4
  Top 0.175: IC7.2 39.73,22.73 34.8,17.8 25.4,17.8 24.8,18.4 24.8,20.8 25.4,21.4 26.3,21.4 26.8,21.9 IC5.21
PRTPWR1
  Top 0.175: IC6.4 25.61,0.69 19.7,6.6 19.7,25.8 20.8,26.9 23.8,26.9 24.4,26.3 IC5.12
PRTPWR2
  Top 0.175: IC5.16 24.3,24.3 23.4,23.4 22.9,23.4 20.5,21 20.5,7.1 25,2.6 27.7,2.6 27.9,2.8 27.9,4.3 27.7,4.5 IC6.1
PRTPWR3
  Top 0.175: IC7.4 42.6,20.1 38.9,20.1 35.4,16.6 25.1,16.6 23.6,18.1 23.6,21.1 25.05,22.55 IC5.18
PRTPWR4
  Top 0.175: IC5.20 26.3,22 26.1,21.8 25.3,21.8 24.4,20.9 24.4,18.3 25.3,17.4 35,17.4 39.7,22.1 44.1,22.1 44.4,22.4 44.4,23.7 44.1,24 IC7.1
RESET_OUT#
  Top 0.175: U4.G1 40,16.8 39,15.8 38.8,15.8 38.7,15.7 38.7,15.45 R15.1 37.35,14.3 36.3,14.3 35.8,13.8 35.8,12.8 35.3,12.3 33.7,12.3 33.2,11.8 31.7,11.8 31.2,11.3 29.7,11.3 29.54,11.14 U1.36
UART1_RX
  Top 0.175: U1.61 34.74,8.94 34.9,9.1 36.4,9.1 38.8,11.5 JP4.9
UART1_TX
  Top 0.175: U1.46 31.54,11.14 31.7,11.3 33.2,11.3 33.8,11.9 36.2,11.9 36.8,12.5 JP4.8
UART2_RX  (via drill 0.3)
  Top 0.175: 54.3,29 IC2.15 54.25,29.2 53.6,29.2 v53.4,29.4 | U1.22 26.74,11.16 26.1,11.8 24.8,11.8 23.8,12.8 23.8,14.5 24.1,14.8 36.8,14.8 v37.2,15.2
  Bottom 0.175: v53.4,29.4 54,28.8 54,26.8 42.4,15.2 v37.2,15.2
UART2_TX  (via drill 0.3)
  Top 0.175: IC2.2 55.77,26.02 56,25.8 56.4,25.8 v56.6,25.6 | U1.27 27.94,6.46 28,6.4 30.4,6.4 v30.6,6.6
  Bottom 0.175: v56.6,25.6 53.6,25.6 42.5,14.5 40.8,14.5 39.8,13.5 39.8,12.3 34.1,6.6 v30.6,6.6
USB2_PWR
  Top 0.7: IC6.8 33.9,4.5 J2.5V
USB3_PWR
  Top 0.7: IC7.5 45.6,20.2 45.2,20.6 45.2,24.4 48.6,27.8 48.6,33 J3.5V
USB4_PWR  (via drill 0.5)
  Top 0.7: IC7.8 47.9,24.9 v47.6,25.2
  Bottom 0.7: v47.6,25.2 42.8,25.2 38,32 J4.5V
USB_DM  (via drill 0.3)
  Top 0.175: 32.4,24.3 IC5.30 32.3,24.3 v32.5,24.1 | U1.18 25.94,9.66 26.2,9.4 30.7,9.4 v30.8,9.3
  Bottom 0.175: v30.8,9.3 31,9.4 31,11.7 31.8,12.5 31.8,21.7 32.6,22.5 32.6,24 v32.5,24.1
USB_DP  (via drill 0.3)
  Top 0.175: U1.16 25.54,9.56 26.1,9 30.3,9 30.6,8.7 31.2,8.7 v31.8,9.3 | v33.2,24.6 33,24.8 IC5.31
  Bottom 0.175: v31.8,9.3 33.8,11.3 33.8,13.6 33.2,14.2 v33.2,24.6
V_1P80  (via drill 0.3)
  Top 0.175: 55.12,26.62 54.17,26.62 v53.4,27.4 | U1.12 24.74,11.26 JP4.1 22.8,14.1 23.9,15.2 36.2,15.2 37.55,16.55 R15.2 38.6,16.65 v38.6,17.5
  Top 0.2: IC2.1 55.12,26.62 C10.1
  Bottom 0.175: v53.4,27.4 53.4,27 43.9,17.5 v38.6,17.5
V_3P30
  Top 0.175: U1.10 U1.8
VCC
  Top 0.178: R8.1 R7.1 57.05,16.25 58.8,18 58.8,18.4 59,18.8
  Top 1: J15.PWR 4,34.1 4.9,35 11.4,35 12,34.4 | J14.PWR 12,34.4 | 12,34.4 12.6,35 19.4,35 20,34.4 J13.PWR | J10.PWR 4,1.6 4.8,0.8 11.6,0.8 12,1.2 | 12,1.2 J12.PWR | J11.PWR 20,1.5 19.3,0.8 12.4,0.8 12,1.2 | 55.6,18.8 55,18.8 53.6,17.4 52.35,17.4 C19.1 | JP3.2 59.86,19.8 | 59.86,19.8 59.86,18.86 59.6,18.8 | C6.1 58.25,21.41 59.86,19.8
  Top 1.016: BAT.P$3 60.86,11.86 62.6,13.6 62.6,18 61.8,18.8 59.6,18.8 59,18.8 55.6,18.8
  Bottom 1: J11.PWR 20,1.4 20.6,0.8 59.2,0.8 60.4,2 BAT.P$3 | J13.PWR 20,34.4 20.6,35 62,35 62.8,34.2 62.8,24.2 59.8,21.2 59.8,20.46 JP3.2
  pour Top (no thermals): 55.8,25.4 56,25.4 56.4,25 56.8,25 57.4,25.6 58.6,25.6 58.8,25.4 58.8,23 58.6,22.8 57.8,22.8 57.4,23.2 56.4,23.2 56.4,24.4 56.2,24.6 55.8,25
  pour Top (no thermals): 48.1,19.2 48.9,19.2 49.7,18.4 51.9,18.4 52.6,17.7 52.6,16.9 52.4,16.7 49.7,16.7 49.5,16.9 48.6,16.9 48.6,18.1 48.3,18.4 48,18.4 48,19.1
VCC_DX  (via drill 0.3, 0.5)
  Top 0.15: 3.77,12.82 C2.1 | R4.2 R3.2
  Top 0.175: IC3.9 IC3.10 3.77,12.82 | R6.2 5.25,17.5 IC3.1 7.12,17.32 IC4.8 7.5,16.95 7.5,18.1 7.95,18.55 R5.2
  Top 0.2: R3.2 R6.2 | IC3.1 6.67,17.32 v6.7,17.3 | IC3.10 3.77,13.18 3.5,12.9 3.1,12.9 v2.9,13
  Top 0.3: IC6.5 29.8,0.69 29,1.5 v29,2.2
  Bottom 0.2: v6.7,17.3 5,15.6 2.9,13.5 v2.9,13
  Bottom 0.3: v29,2.2 29,2.5 18.8,12.7 7.9,12.7 5,15.6

### Text on the board
tPlace: Nico v1.0.2 | GND | 3.3V | IC5 | VBAT | GND | 5V | GND
tNames: U4